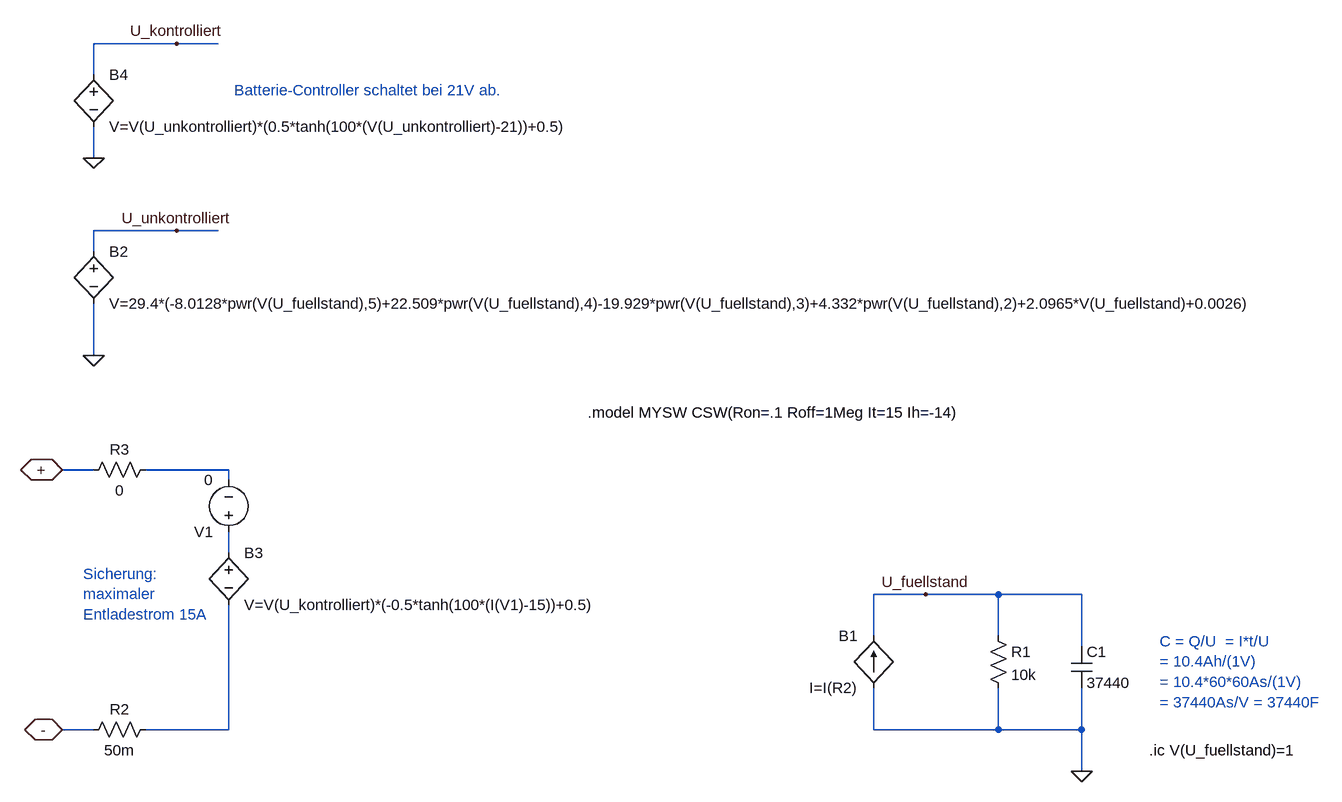
[diagram p0: schematic Fahrradakku24V104daAh.asc]
Fahrradakku24V104daAh.asc, the LTspice schematic file:
Version 4
SHEET 1 2044 680
WIRE -624 -752 -752 -752
WIRE -560 -752 -624 -752
WIRE -752 -704 -752 -752
WIRE -752 -576 -752 -624
WIRE -624 -464 -752 -464
WIRE -560 -464 -624 -464
WIRE -752 -432 -752 -464
WIRE -752 -272 -752 -352
WIRE -752 -96 -800 -96
WIRE -544 -96 -672 -96
WIRE -544 -80 -544 -96
WIRE -544 32 -544 0
WIRE 528 96 448 96
WIRE 640 96 528 96
WIRE 768 96 640 96
WIRE 448 160 448 96
WIRE 640 160 640 96
WIRE 768 176 768 96
WIRE -752 304 -800 304
WIRE -544 304 -544 112
WIRE -544 304 -672 304
WIRE 448 304 448 240
WIRE 640 304 640 240
WIRE 640 304 448 304
WIRE 768 304 768 240
WIRE 768 304 640 304
WIRE 768 368 768 304
FLAG 528 96 U_fuellstand
FLAG -800 -96 +
IOPIN -800 -96 BiDir
FLAG -800 304 -
IOPIN -800 304 BiDir
FLAG -624 -464 U_unkontrolliert
FLAG 768 368 0
FLAG -752 -272 0
FLAG -624 -752 U_kontrolliert
FLAG -752 -576 0
SYMBOL cap 752 176 R0
SYMATTR InstName C1
SYMATTR Value 37440
SYMBOL res 624 144 R0
SYMATTR InstName R1
SYMATTR Value 10k
SYMBOL bi 448 240 R180
WINDOW 0 24 80 Left 2
WINDOW 3 24 0 Left 2
SYMATTR InstName B1
SYMATTR Value I=I(R2)
SYMBOL res -656 288 R90
WINDOW 0 0 56 VBottom 2
WINDOW 3 32 56 VTop 2
SYMATTR InstName R2
SYMATTR Value 50m
SYMBOL bv -752 -448 R0
SYMATTR InstName B2
SYMATTR Value V=29.4*(-8.0128*pwr(V(U_fuellstand),5)+22.509*pwr(V(U_fuellstand),4)-19.929*pwr(V(U_fuellstand),3)+4.332*pwr(V(U_fuellstand),2)+2.0965*V(U_fuellstand)+0.0026)
SYMBOL res -656 -112 R90
WINDOW 0 0 56 VBottom 2
WINDOW 3 32 56 VTop 2
SYMATTR InstName R3
SYMATTR Value 0
SYMBOL bv -544 16 R0
SYMATTR InstName B3
SYMATTR Value V=V(U_kontrolliert)*(-0.5*tanh(100*(I(V1)-15))+0.5)
SYMBOL voltage -544 16 R180
WINDOW 123 0 0 Left 0
WINDOW 39 0 0 Left 0
SYMATTR InstName V1
SYMATTR Value 0
SYMBOL bv -752 -720 R0
SYMATTR InstName B4
SYMATTR Value V=V(U_unkontrolliert)*(0.5*tanh(100*(V(U_unkontrolliert)-21))+0.5)
TEXT 888 168 Left 2 ;C = Q/U  = I*t/U\n= 10.4Ah/(1V) \n= 10.4*60*60As/(1V)\n= 37440As/V = 37440F
TEXT 872 336 Left 2 !.ic V(U_fuellstand)=1
TEXT 8 -184 Left 2 !.model MYSW CSW(Ron=.1 Roff=1Meg It=15 Ih=-14)
TEXT -768 64 Left 2 ;Sicherung:\nmaximaler\nEntladestrom 15A
TEXT -536 -680 Left 2 ;Batterie-Controller schaltet bei 21V ab.

The netlist it stands for:
* Fahrradakku24V104daAh.asc
C1 U_fuellstand 0 37440
R1 U_fuellstand 0 10k
B1 0 U_fuellstand I=I(R2)
R2 N003 - 50m
B2 U_unkontrolliert 0 V=29.4*(-8.0128*pwr(V(U_fuellstand),5)+22.509*pwr(V(U_fuellstand),4)-19.929*pwr(V(U_fuellstand),3)+4.332*pwr(V(U_fuellstand),2)+2.0965*V(U_fuellstand)+0.0026)
R3 N001 + 0
B3 N002 N003 V=V(U_kontrolliert)*(-0.5*tanh(100*(I(V1)-15))+0.5)
V1 N002 N001 0
B4 U_kontrolliert 0 V=V(U_unkontrolliert)*(0.5*tanh(100*(V(U_unkontrolliert)-21))+0.5)
* C = Q/U  = I*t/U
* = 10.4Ah/(1V)
* = 10.4*60*60As/(1V)
* = 37440As/V = 37440F
.ic V(U_fuellstand)=1
.model MYSW CSW(Ron=.1 Roff=1Meg It=15 Ih=-14)
* Sicherung:
* maximaler
* Entladestrom 15A
* Batterie-Controller schaltet bei 21V ab.
.backanno
.end